# EAGLE design ACMon (EAGLE 7.2.0)
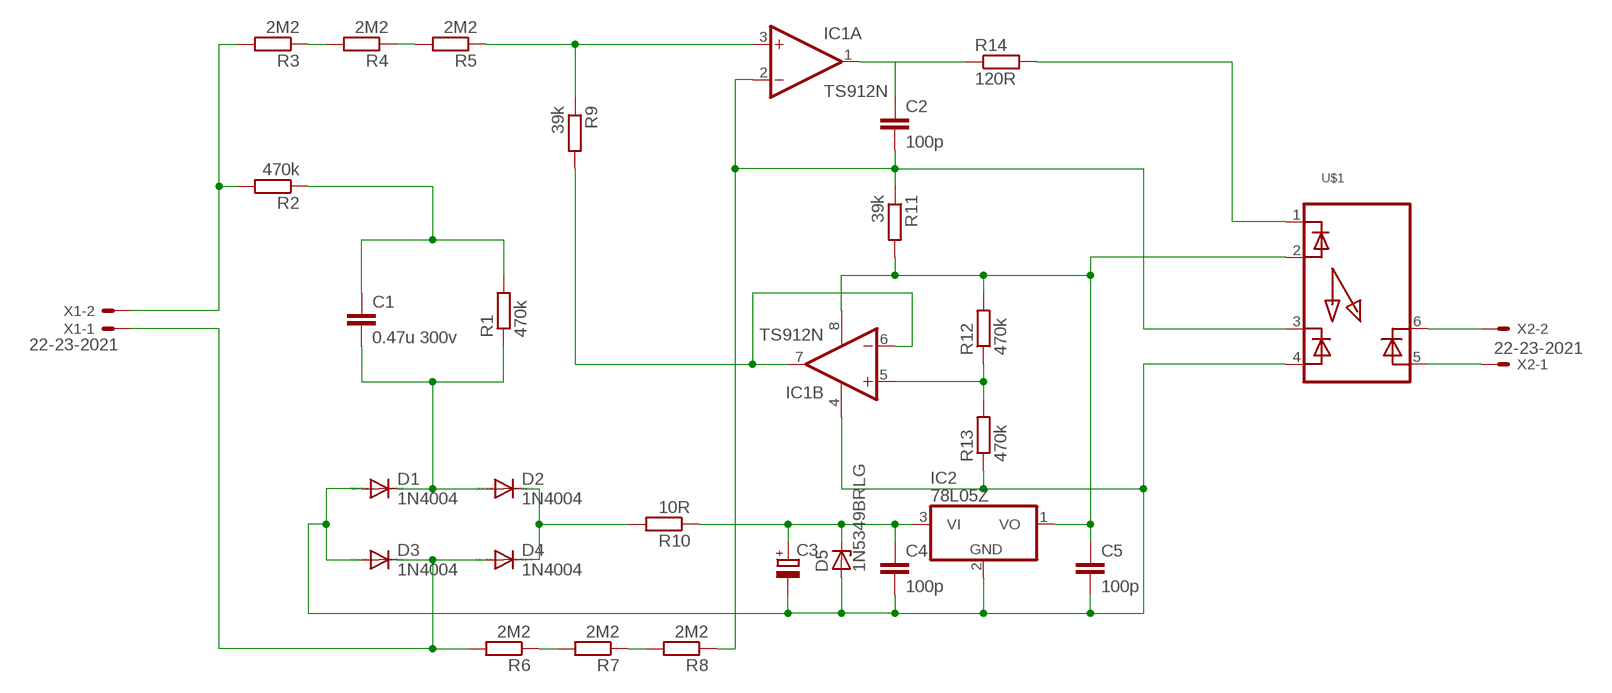
[diagram p0: schematic, sheet 1]

## Parts
C1  0.47u 300v  C-EU275-113X316  [C275-113X316]
C2  100p  C-EU050-025X075  [C050-025X075]
C3  CPOL-EUE3.5-8  [E3,5-8]
C4  100p  C-EU050-025X075  [C050-025X075]
C5  100p  C-EU050-025X075  [C050-025X075]
D1  1N4004  [DO41-10]
D2  1N4004  [DO41-10]
D3  1N4004  [DO41-10]
D4  1N4004  [DO41-10]
D5  1N5349BRLG  [DO41Z10]
IC1  TS912N  [DIL08]
IC2  78L05Z  [TO92]
R1  470k  R-EU_0309/12  [0309/12]
R2  470k  R-EU_0309/12  [0309/12]
R3  2M2  R-EU_0309/12  [0309/12]
R4  2M2  R-EU_0309/12  [0309/12]
R5  2M2  R-EU_0309/12  [0309/12]
R6  2M2  R-EU_0309/12  [0309/12]
R7  2M2  R-EU_0309/12  [0309/12]
R8  2M2  R-EU_0309/12  [0309/12]
R9  39k  R-EU_0309/12  [0309/12]
R10  10R  R-EU_0309/12  [0309/12]
R11  39k  R-EU_0309/12  [0309/12]
R12  470k  R-EU_0309/12  [0309/12]
R13  470k  R-EU_0309/12  [0309/12]
R14  120R  R-EU_0309/12  [0309/12]
U$1  IL300  [DIL08]
X1  22-23-2021  [22-23-2021]
X2  22-23-2021  [22-23-2021]

## Nets
N$1: C1.1 R1.2 R2.1
N$2: C1.2 D1.C D2.A R1.1
N$3: C3.- C4.2 C5.2 D1.A D3.A D5.A IC1.4(P:V-) IC2.2(GND) R13.1 U$1.4
N$4: D3.C D4.A R6.2 X1.1
N$5: R6.1 R7.2
N$6: D2.C D4.C R10.2
N$7: R2.2 R3.2 X1.2
N$8: R3.1 R4.2
N$9: R4.1 R5.2
N$10: IC1.3(A:+IN) R5.1 R9.1
N$11: IC1.6(B:-IN) IC1.7(B:OUT) R9.2
N$12: R7.1 R8.2
N$13: C2.2 IC1.2(A:-IN) R8.1 R11.1 U$1.3
N$14: C2.1 IC1.1(A:OUT) R14.1
N$15: R14.2 U$1.1
N$16: C3.+ C4.1 D5.C IC2.3(VI) R10.1
N$17: U$1.6 X2.2
N$18: C5.1 IC1.8(P:V+) IC2.1(VO) R11.2 R12.2 U$1.2
N$19: U$1.5 X2.1
N$22: IC1.5(B:+IN) R12.1 R13.2

## Library data of the parts
C1 C2 C4 C5 = resistor:C-EU: CAPACITOR, European symbol
C3 = resistor:CPOL-EU: POLARIZED CAPACITOR, European symbol
D1-D4 = diode:1N4004: DIODE general purpose rectifier, 1 A
D5 = il300:1N5349BRLG: Z DIODE 12 V, 5W, 5 percent
IC1 = il300:TS912: OP AMP Source: http://www.st.com/content/ccc/resource/technical/document/datasheet/3b/16/fd/19/b8/21/40/7f/CD00000501.pdf/files/CD00000501.pdf/jcr:content/translations/en.CD00000501.pdf
IC2 = linear:78*: Positive VOLTAGE REGULATOR Source: http://cache.national.com/ds/LM/LM78L05.pdf http://www.fairchildsemi.com/ds/LM/LM7805.pdf
R1-R14 = resistor:R-EU_: RESISTOR, European symbol
U$1 = il300:IL300
X1 X2 = con-molex:22-23-2021: .100" (2.54mm) Center Header - 2 Pin; MF: MOLEX; MPN: 22-23-2021; OC_FARNELL: 1462926; OC_NEWARK: 25C3832

## Board
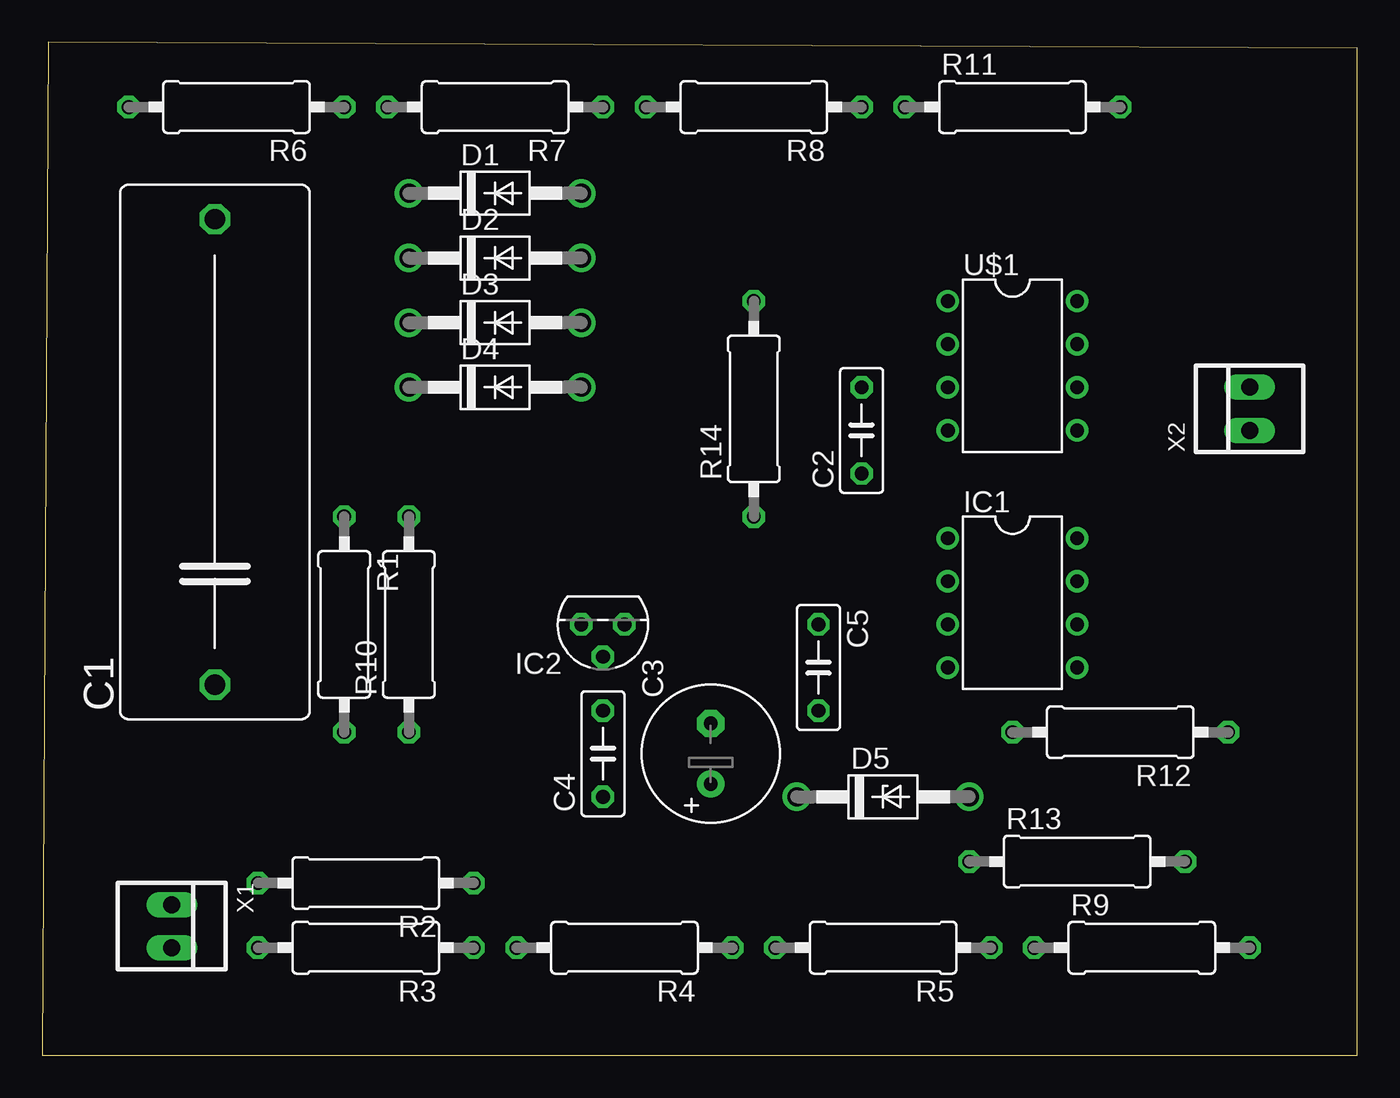
[diagram p1: board, top side]
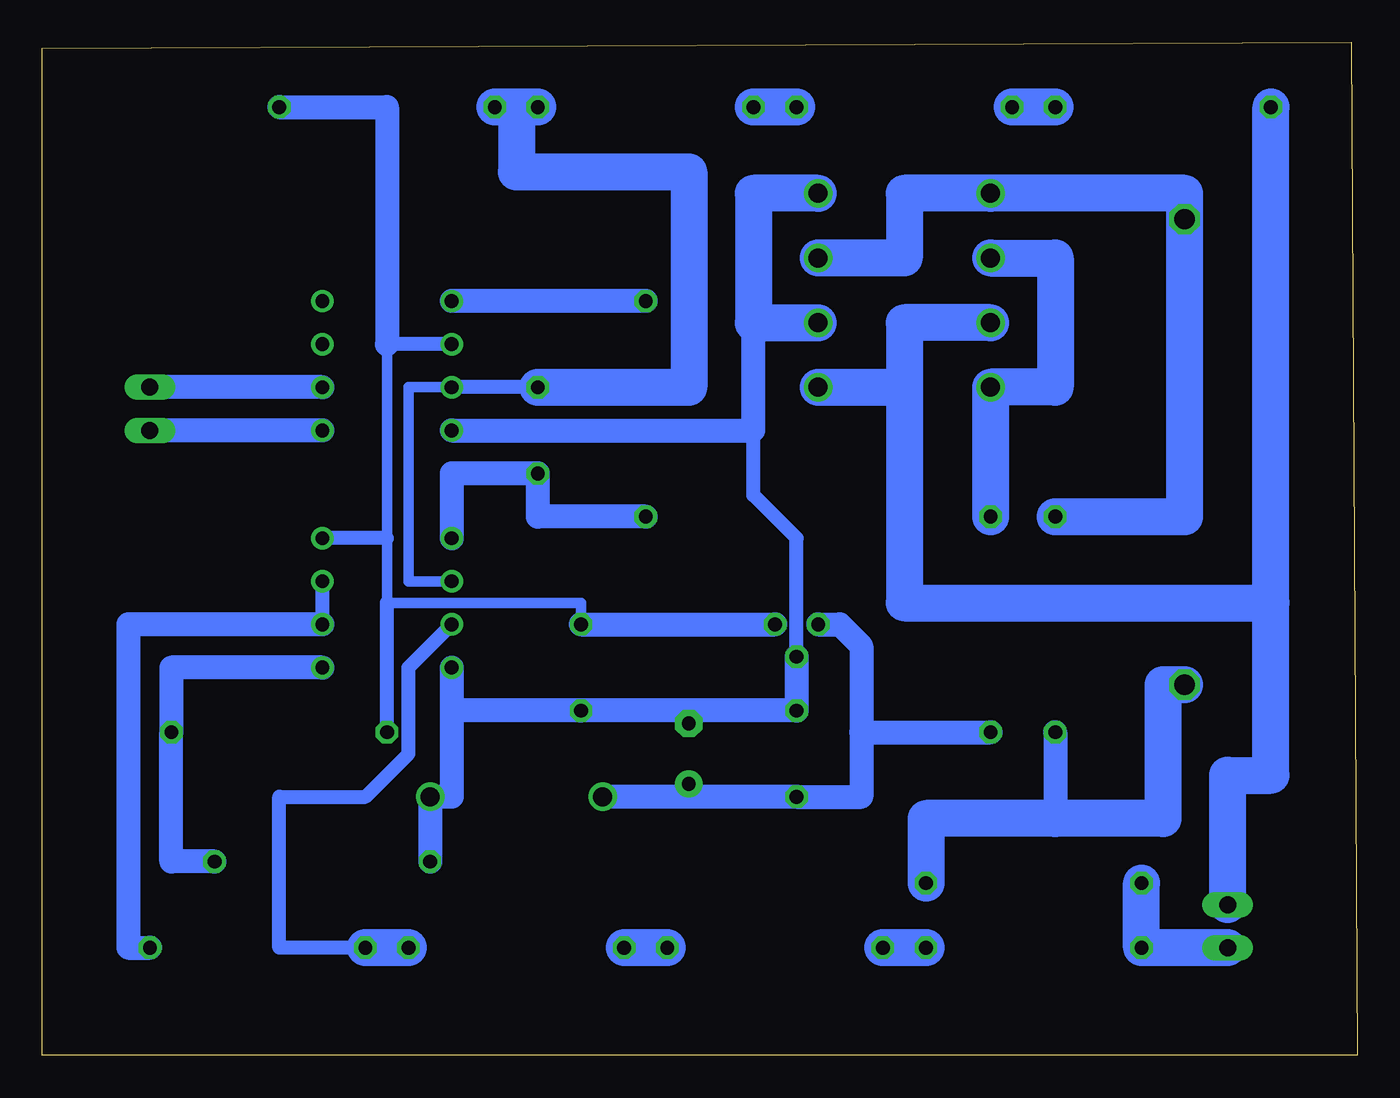
[diagram p2: board, bottom side, seen from below]

Size 77.45 x 59.69 mm. Coordinates in mm from the lower left corner, seen from the top.
Outline: 0,0 77.45,0 77.45,59.36 0.33,59.69 0,0
Copper layers (1*16): Top 0.035mm / dielectric 1.5mm / Bottom 0.035mm
Design rules "default": minimum track width 10mil, minimum drill 24mil, track to track 8mil, track to pad 8mil, pad to pad 8mil, via to via 8mil, smd to smd 8mil, copper to edge 40mil, drill to drill 8mil, minimum pad ring 10mil, minimum via ring 8mil, stop-mask expansion 4mil, vias tented up to drill 0mil, thermal gap 10mil

### Footprints (pad centres in the part's own frame; a part is rotated, then mirrored left to right if it is on the bottom)
C275-113X316 = drill 1.194 octagon: 1 -13.716,0; 2 13.716,0
C050-025X075 = drill 0.813 octagon: 1 -2.54,0; 2 2.54,0
E3,5-8 = drill 0.813 pad 1.6: + -1.778,0 | drill 0.813 pad 1.6 octagon: - 1.778,0
DO41-10 = drill 1.118: A 5.08,0; C -5.08,0
DO41Z10 = drill 1.118: A 5.08,0; C -5.08,0
DIL08 = drill 0.813 pad 1.27: 1 -3.81,-3.81; 2 -1.27,-3.81; 3 1.27,-3.81; 4 3.81,-3.81; 5 3.81,3.81; 6 1.27,3.81; 7 -1.27,3.81; 8 -3.81,3.81
TO92 = drill 0.813 octagon: 1 -1.27,0; 2 0,1.905; 3 1.27,0
0309/12 = drill 0.813 octagon: 1 -6.35,0; 2 6.35,0
22-23-2021 = drill 1 long: 1 -1.27,0; 2 1.27,0

### Placement (x,y rotation side)
C1  10.16,35.56 90 top
C2  48.26,36.83 90 top
C3  39.37,17.78 90 top
C4  33.02,17.78 90 top
C5  45.72,22.86 270 top
D1  26.67,50.8 0 top
D2  26.67,46.99 0 top
D3  26.67,43.18 0 top
D4  26.67,39.37 0 top
D5  49.53,15.24 0 top
IC1  57.15,26.67 270 top
IC2  33.02,25.4 180 top
R1  17.78,25.4 270 top
R2  19.05,10.16 180 top
R3  19.05,6.35 180 top
R4  34.29,6.35 180 top
R5  49.53,6.35 180 top
R6  11.43,55.88 180 top
R7  26.67,55.88 180 top
R8  41.91,55.88 180 top
R9  64.77,6.35 0 top
R10  21.59,25.4 90 top
R11  57.15,55.88 0 top
R12  63.5,19.05 180 top
R13  60.96,11.43 0 top
R14  41.91,38.1 90 top
U$1  57.15,40.64 270 top
X1  7.62,7.62 270 top
X2  71.12,38.1 90 top

### Tracks (layer width: path | path; a pad name or v marks a point on that pad's centre or on a via)
N$1
  Bottom 1.422: R1.2 17.78,13.97
  Bottom 2.184: C1.1 11.43,21.84 11.43,13.97 17.78,13.97 25.4,13.97 R2.1
N$2
  Bottom 2.184: D2.A 26.67,46.99 26.67,50.8 D1.C 10.16,50.8 C1.2 10.16,31.75 R1.1
N$3
  Bottom 0.813: IC2.2 33.02,30.48 35.56,33.02 35.56,36.83
  Bottom 1.422: 35.56,43.18 35.56,36.83 U$1.4 | IC2.2 C4.2 39.37,20.32 | R13.1 D5.A 53.34,15.24 53.34,20.32 | IC1.4 53.34,20.32 | 53.34,20.32 C5.2 39.37,20.32 | C3.- 39.37,20.32
  Bottom 2.184: D1.A 35.56,50.8 35.56,43.18 D3.A
N$4
  Bottom 2.184: X1.1 7.62,16.51 5.08,16.51 5.08,26.67 | 5.08,26.67 R6.2 | D3.C 26.67,43.18 26.67,39.37 | D4.A 26.67,39.37 | 26.67,39.37 26.67,26.67 5.08,26.67
N$5
  Bottom 2.184: R6.1 R7.2
N$6
  Bottom 2.184: D2.C 17.78,46.99 17.78,39.37 D4.C R10.2
N$7
  Bottom 2.184: X1.2 R3.2 R2.2
N$8
  Bottom 2.184: R3.1 R4.2
N$9
  Bottom 2.184: R4.1 R5.2
N$10
  Bottom 0.813: R5.1 63.5,6.35 63.5,15.24 58.42,15.24 55.88,17.78 55.88,22.86 IC1.3
  Bottom 2.184: R5.1 R9.1
N$11
  Bottom 0.813: IC1.7 IC1.6
  Bottom 1.422: IC1.6 72.39,25.4 72.39,6.35 R9.2
N$12
  Bottom 2.184: R7.1 R8.2
N$13
  Bottom 0.61: U$1.3 55.88,39.37 55.88,27.94 IC1.2
  Bottom 0.813: C2.2 U$1.3
  Bottom 2.184: R8.1 49.53,55.88 | 49.53,55.88 R11.1 | C2.2 39.37,39.37 39.37,52.07 49.53,52.07 49.53,55.88
N$14
  Bottom 1.422: R14.1 48.26,31.75 C2.1 53.34,34.29 IC1.1
N$15
  Bottom 1.422: R14.2 U$1.1
N$16
  Bottom 1.422: 29.21,19.05 R10.1 | IC2.3 30.48,25.4 29.21,24.13 29.21,19.05 | 29.21,19.05 29.21,15.24 C4.1 39.37,15.24 | 39.37,15.24 C3.+ | 39.37,15.24 D5.C
N$17
  Bottom 1.422: U$1.6 X2.2
N$18
  Bottom 0.61: 57.15,41.91 57.15,30.48 57.15,26.67 45.72,26.67 C5.1
  Bottom 0.813: U$1.2 57.15,41.91 | 57.15,30.48 IC1.8 | R12.2 57.15,26.67
  Bottom 1.422: C5.1 IC2.1 | R11.2 57.15,55.88 57.15,41.91
N$19
  Bottom 1.422: U$1.5 X2.1
N$22
  Bottom 1.422: IC1.5 69.85,22.86 R12.1 69.85,11.43 R13.2